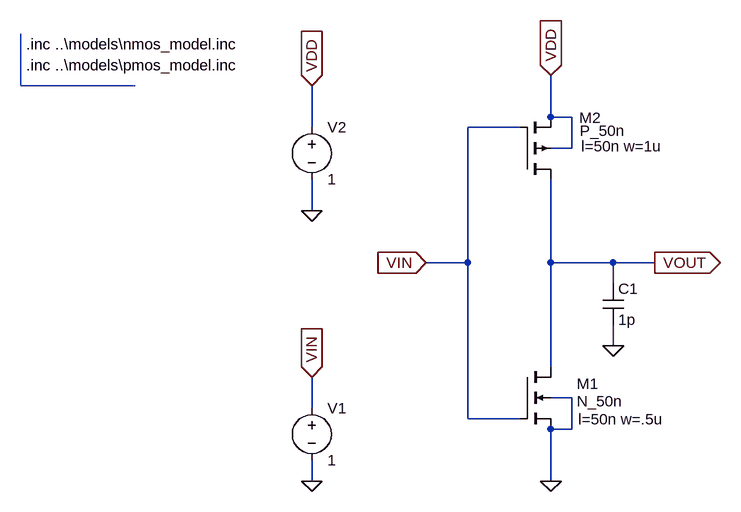
[diagram p0: schematic cmos_inverter.asc]
cmos_inverter.asc, the LTspice schematic file:
Version 4.1
SHEET 1 880 680
WIRE 288 -32 288 -96
WIRE 320 -32 288 -32
WIRE -80 -16 -80 -80
WIRE 240 -16 160 -16
WIRE 320 16 320 -32
WIRE 320 16 288 16
WIRE -80 112 -80 64
WIRE 160 192 160 -16
WIRE 160 192 96 192
WIRE 288 192 288 64
WIRE 384 192 288 192
WIRE 448 192 384 192
WIRE 384 224 384 192
WIRE 384 320 384 288
WIRE 288 352 288 192
WIRE 320 400 288 400
WIRE -80 416 -80 368
WIRE 160 432 160 192
WIRE 240 432 160 432
WIRE 320 448 320 400
WIRE 320 448 288 448
WIRE -80 528 -80 496
WIRE 288 528 288 448
FLAG -80 112 0
FLAG -80 528 0
FLAG 288 528 0
FLAG 288 -96 VDD
IOPIN 288 -96 In
FLAG -80 -80 VDD
IOPIN -80 -80 In
FLAG -80 368 VIN
IOPIN -80 368 In
FLAG 96 192 VIN
IOPIN 96 192 In
FLAG 448 192 VOUT
IOPIN 448 192 Out
FLAG 384 320 0
SYMBOL nmos4 240 352 R0
WINDOW 0 88 26 Left 2
WINDOW 3 88 53 Left 2
WINDOW 123 90 81 Left 2
SYMATTR InstName M1
SYMATTR Value N_50n
SYMATTR Value2 l=50n w=.5u
SYMBOL pmos4 240 64 M180
WINDOW 0 92 95 Left 2
WINDOW 3 93 75 Left 2
WINDOW 123 95 51 Left 2
SYMATTR InstName M2
SYMATTR Value P_50n
SYMATTR Value2 l=50n w=1u
SYMBOL voltage -80 400 R0
SYMATTR InstName V1
SYMATTR Value 1
SYMBOL voltage -80 -32 R0
SYMATTR InstName V2
SYMATTR Value 1
SYMBOL cap 368 224 R0
SYMATTR InstName C1
SYMATTR Value 1p
TEXT -520 -144 Left 2 !.inc ..\\models\\nmos_model.inc
TEXT -520 -112 Left 2 !.inc ..\\models\\pmos_model.inc
LINE Normal -528 -80 -528 -160
LINE Normal -352 -80 -528 -80

The netlist it stands for:
* cmos_inverter.asc
M1 VOUT VIN 0 0 N_50n l=50n w=.5u
M2 VOUT VIN VDD VDD P_50n l=50n w=1u
V1 VIN 0 1
V2 VDD 0 1
C1 VOUT 0 1p
.model NMOS NMOS
.model PMOS PMOS
.lib standard.mos
.inc ..\models\nmos_model.inc
.inc ..\models\pmos_model.inc
.backanno
.end